# EAGLE schematic Infinity Mirror_002 (EAGLE 7.3.0)
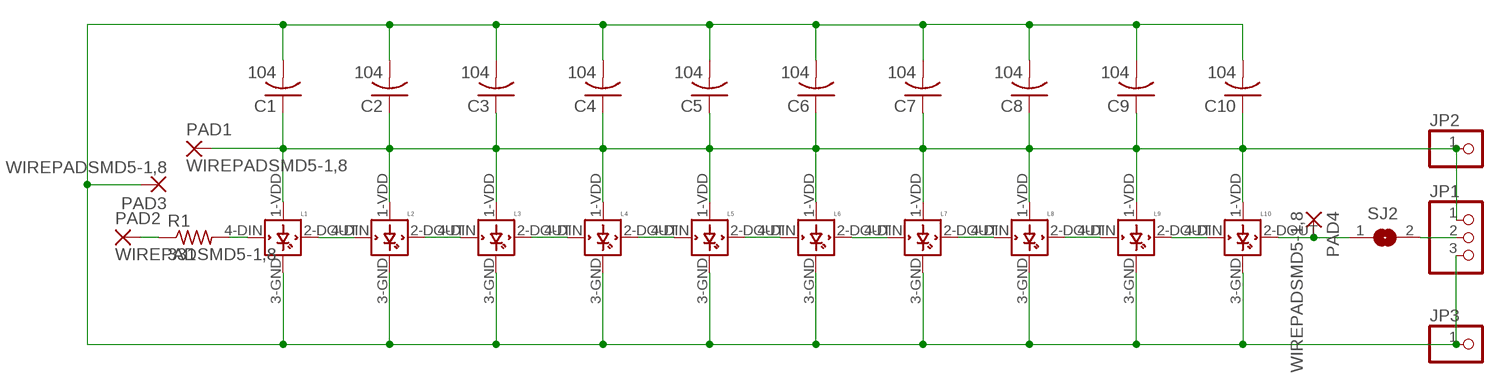
[diagram p0: schematic, sheet 1]

## Parts
C1  104  C-USC1206  [C1206]
C2  104  C-USC1206  [C1206]
C3  104  C-USC1206  [C1206]
C4  104  C-USC1206  [C1206]
C5  104  C-USC1206  [C1206]
C6  104  C-USC1206  [C1206]
C7  104  C-USC1206  [C1206]
C8  104  C-USC1206  [C1206]
C9  104  C-USC1206  [C1206]
C10  104  C-USC1206  [C1206]
JP1  PINHD-1X3CB  [1X03-CLEANBIG]
JP2  PINHD-1X1CB  [1X01-CLEANBIG]
JP3  PINHD-1X1CB  [1X01-CLEANBIG]
L1  WS2812B  [WS2812B]
L2  WS2812B  [WS2812B]
L3  WS2812B  [WS2812B]
L4  WS2812B  [WS2812B]
L5  WS2812B  [WS2812B]
L6  WS2812B  [WS2812B]
L7  WS2812B  [WS2812B]
L8  WS2812B  [WS2812B]
L9  WS2812B  [WS2812B]
L10  WS2812B  [WS2812B]
PAD1  WIREPADSMD5-1,8  [5-1,8]
PAD2  WIREPADSMD5-1,8  [5-1,8]
PAD3  WIREPADSMD5-1,8  [5-1,8]
PAD4  WIREPADSMD5-1,8  [5-1,8]
R1  331  R-US_R1206  [R1206]
SJ2  SJ  [SJ]

## Nets
N$1: L2.2-DOUT(DOUT) L3.4-DIN(DIN)
N$2: L3.2-DOUT(DOUT) L4.4-DIN(DIN)
N$3: L4.2-DOUT(DOUT) L5.4-DIN(DIN)
N$4: L5.2-DOUT(DOUT) L6.4-DIN(DIN)
N$5: L6.2-DOUT(DOUT) L7.4-DIN(DIN)
N$6: L1.2-DOUT(DOUT) L2.4-DIN(DIN)
N$7: L7.2-DOUT(DOUT) L8.4-DIN(DIN)
N$8: L8.2-DOUT(DOUT) L9.4-DIN(DIN)
N$9: C1.1 C2.1 C3.1 C4.1 C5.1 C6.1 C7.1 C8.1 C9.1 C10.1 JP1.1 JP2.1 L1.1-VDD(VDD) L2.1-VDD(VDD) L3.1-VDD(VDD) L4.1-VDD(VDD) L5.1-VDD(VDD) L6.1-VDD(VDD) L7.1-VDD(VDD) L8.1-VDD(VDD) L9.1-VDD(VDD) L10.1-VDD(VDD) PAD1.1(P)
N$10: PAD2.1(P) R1.1
N$11: C1.2 C2.2 C3.2 C4.2 C5.2 C6.2 C7.2 C8.2 C9.2 C10.2 JP1.3 JP3.1 L1.3-GND(GND) L2.3-GND(GND) L3.3-GND(GND) L4.3-GND(GND) L5.3-GND(GND) L6.3-GND(GND) L7.3-GND(GND) L8.3-GND(GND) L9.3-GND(GND) L10.3-GND(GND) PAD3.1(P)
N$12: L9.2-DOUT(DOUT) L10.4-DIN(DIN)
N$14: L10.2-DOUT(DOUT) PAD4.1(P) SJ2.1
N$19: JP1.2 SJ2.2
N$20: L1.4-DIN(DIN) R1.2

## Library data of the parts
C1-C10 = adafruit:C-US: CAPACITOR, American symbol
JP1 = adafruit:PINHD-1X3: PIN HEADER
JP2 JP3 = adafruit:PINHD-1X1: Pin header 1x1 for 0.1" spacing With round pins
L1-L10 = adafruit:WS2812B
PAD1-PAD4 = wirepad:WIREPAD: Wire PAD connect wire on PCB
R1 = resistor:R-US_: RESISTOR, American symbol
SJ2 = jumper:SJ: SMD solder JUMPER